# EAGLE design gwx-control (EAGLE 7.7.0)
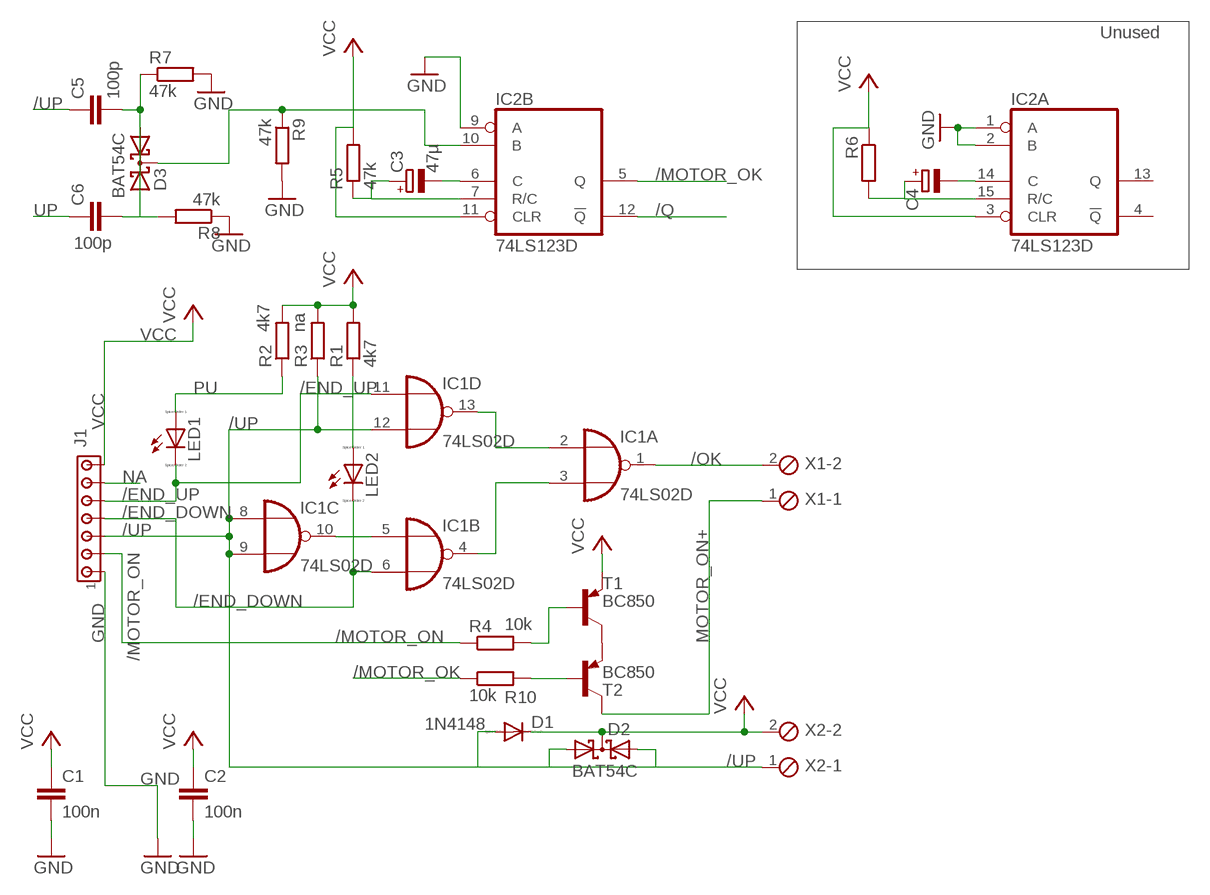
[diagram p0: schematic, sheet 1]

## Parts
C1  100n  C-EUC0603K  [C0603K]
C2  100n  C-EUC0603K  [C0603K]
C3  47µ  CPOL-EUE5-6  [E5-6]
C4  CPOL-EUE5-6  [E5-6]
C5  100p  C-EUC0603K  [C0603K]
C6  100p  C-EUC0603K  [C0603K]
D1  1N4148  1N4148DO35-10  [DO35-10]
D2  BAT54C  [SOT23]
D3  BAT54C  [SOT23]
IC1  74LS02D  [SO14]
IC2  74LS123D  [SO16]
J1  MTA07-100  [10X07MTA]
LED1  LED_ESML0603  [LED_SML0603]
LED2  LED_ESML0603  [LED_SML0603]
R1  4k7  R-EU_R0603  [R0603]
R2  4k7  R-EU_R0603  [R0603]
R3  na  R-EU_R0603  [R0603]
R4  10k  R-EU_R0603  [R0603]
R5  47k  R-EU_R0603  [R0603]
R6  R-EU_R0603  [R0603]
R7  47k  R-EU_R0603  [R0603]
R8  47k  R-EU_R0603  [R0603]
R9  47k  R-EU_R0603  [R0603]
R10  10k  R-EU_R0603  [R0603]
T1  BC850  BC856B-PNP-SOT23-BEC  [SOT23-BEC]
T2  BC850  BC856B-PNP-SOT23-BEC  [SOT23-BEC]
X1  MPT2  [2POL254]
X2  MPT2  [2POL254]

## Nets
/END_DOWN: IC1.6(B:I1) J1.4 LED2.C
/END_UP: IC1.11(D:I0) J1.5 LED1.C
/MOTOR_OK: IC2.5(B:Q) R10.1
/MOTOR_ON: J1.2 R4.1
/OK: IC1.1(A:O) X1.2
/Q: IC2.12(B:!Q)
/UP: C5.1 D1.A D2.1(A1) D2.2(A2) IC1.8(C:I0) IC1.9(C:I1) IC1.12(D:I1) J1.3 R3.1 X2.1
GND: C1.2 C2.2 IC2.1(A:A) IC2.2(A:B) IC2.9(B:A) J1.1 R7.2 R8.1 R9.2
MOTOR_ON+: T2.C X1.1
N$1: C3.+ IC2.7(B:R/C) R5.1
N$2: C3.- IC2.6(B:C)
N$3: C4.+ IC2.15(A:R/C) R6.2
N$4: C5.2 D3.2(A2) R7.1
N$5: IC1.2(A:I0) IC1.13(D:O)
N$6: IC1.3(A:I1) IC1.4(B:O)
N$7: C6.2 D3.1(A1) R8.2
N$8: D3.3(CC) IC2.10(B:B) R9.1
N$9: C4.- IC2.14(A:C)
N$10: R10.2 T2.B
N$11: R4.2 T1.B
N$12: T1.C T2.E
N$15: LED2.A R1.1
NA: J1.6
PU: LED1.A R2.1
UP: C6.1 IC1.5(B:I0) IC1.10(C:O)
VCC: C1.1 C2.1 D1.C D2.3(CC) IC2.3(A:CLR) IC2.11(B:CLR) J1.7 R1.2 R2.2 R3.2 R5.2 R6.1 T1.E X2.2
Unconnected: IC2.4(A:!Q) IC2.13(A:Q)

## Notes on the sheet
- Unused

## Power pins joined to a net without a drawn wire
GND: IC1.7(P:GND) IC2.8(P:GND)
VCC: IC1.14(P:VCC) IC2.16(P:VCC)

## Library data of the parts
C1 C2 C5 C6 = rcl:C-EU: CAPACITOR, European symbol
C3 C4 = rcl:CPOL-EU: POLARIZED CAPACITOR, European symbol
D1 = diode:1N4148: DIODE high speed (Philips)
D2 D3 = diode:BAT54C: Schottky Diodes Source: Fairchild .. BAT54.pdf
IC1 = 74xx-eu:74*02: Quad 2-input NOR gate
IC2 = 74xx-eu:74*123: Retriggerable monostable MULTIVIBRATOR
J1 = con-amp:MTA07-100: AMP connector
LED1 LED2 = eagle-ltspice:LED_E: LED Source: http://www.osram.convergy.de Source: www.luxeon.com Source: www.kingbright.com; SPICEMODEL: NONE; SPICEPREFIX: D; SPICETYPE: diode
R1-R4 R10 = resistor:R-EU_: RESISTOR, European symbol
R5-R9 = rcl:R-EU_: RESISTOR, European symbol
T1 T2 = transistor:*-PNP-: PNP Transistror
X1 X2 = con-phoenix-254:MPT2: PHOENIX CONNECTOR; OC_FARNELL: unknown; OC_NEWARK: unknown

## Board
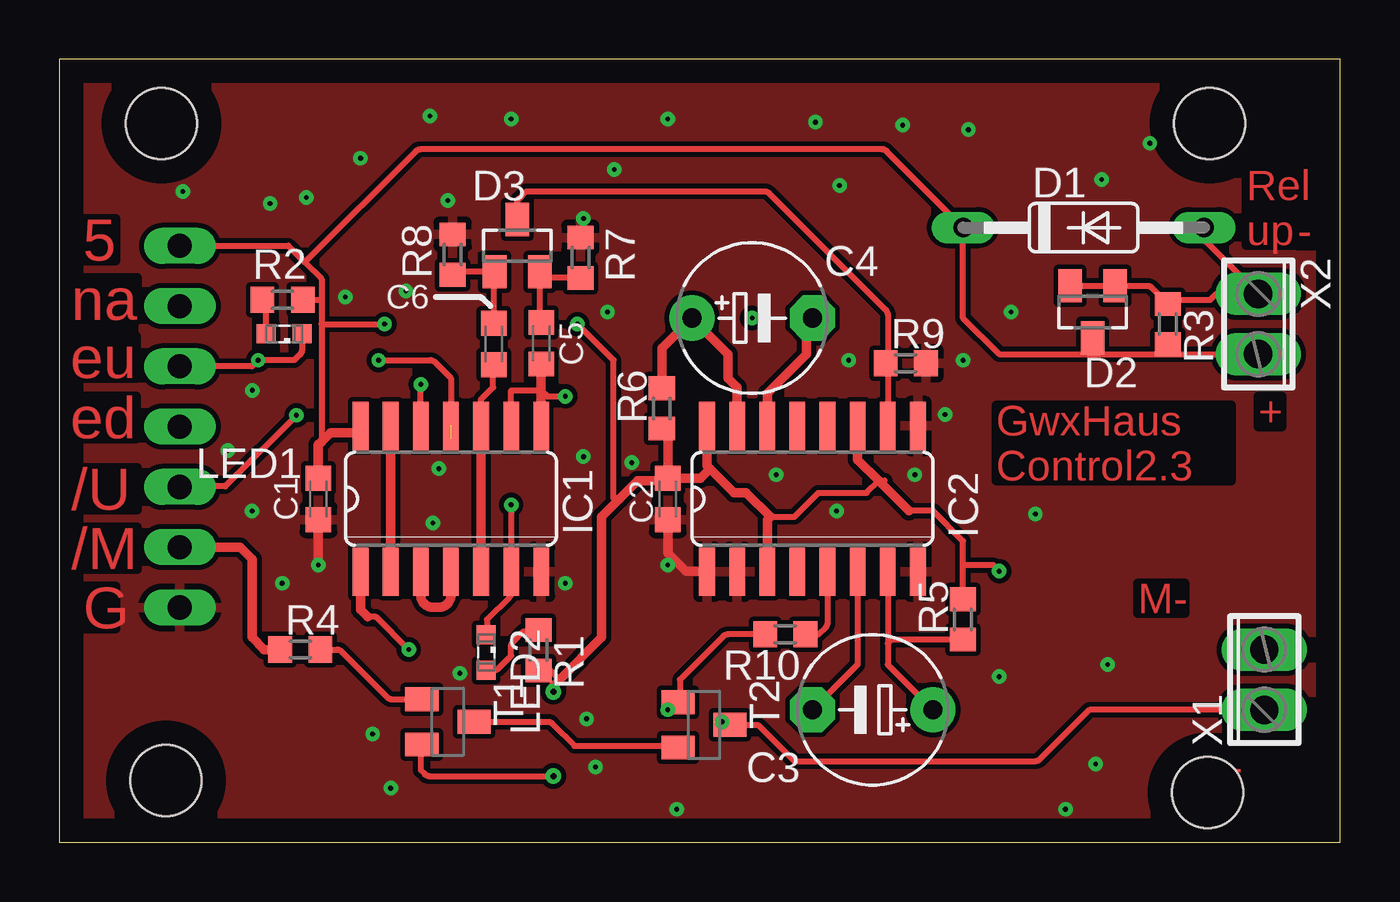
[diagram p1: board, top side]
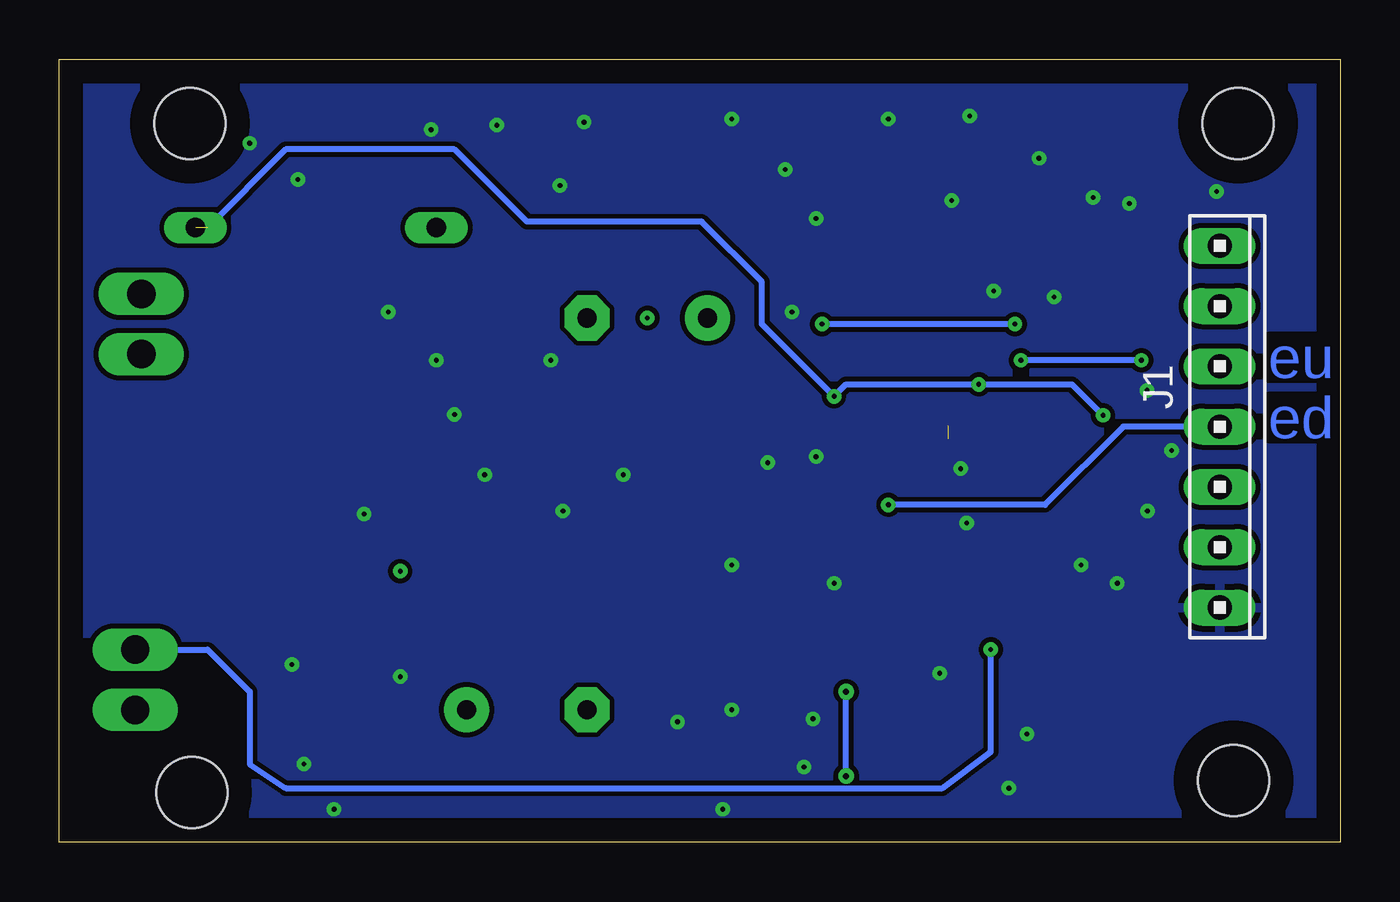
[diagram p2: board, bottom side, seen from below]

Size 54 x 33 mm. Coordinates in mm from the lower left corner, seen from the top.
Outline: 0,0 54,0 54,33 0,33 0,0
Copper layers (1*16): Top 0.035mm / dielectric 1.5mm / Bottom 0.035mm
Design rules "default *": minimum track width 10mil, minimum drill 24mil, track to track 8mil, track to pad 8mil, pad to pad 8mil, via to via 8mil, smd to smd 8mil, copper to edge 40mil, drill to drill 8mil, minimum pad ring 10mil, minimum via ring 8mil, stop-mask expansion 4mil, vias tented up to drill 13mil, thermal gap 10mil
Holes 3 mm at 4.3,30.3 4.5,2.6 48.5,30.3 48.4,2.1

### Footprints (pad centres in the part's own frame; a part is rotated, then mirrored left to right if it is on the bottom)
C0603K = smd 1.05 x 1.08: 1 -0.875,0; 2 0.875,0
E5-6 = drill 0.813 pad 1.905: + -2.54,0 | drill 0.813 pad 1.905 octagon: - 2.54,0
DO35-10 = drill 0.813 long: A 5.08,0; C -5.08,0
SOT23 = smd 1 x 1.4: 1 -0.95,-1.1; 2 0.95,-1.1; 3 0,1.1
SO14 = smd 0.66 x 2.032: 1 -3.81,-3.073; 2 -2.54,-3.073; 3 -1.27,-3.073; 4 0,-3.073; 5 1.27,-3.073; 6 2.54,-3.073; 7 3.81,-3.073; 8 3.81,3.073; 9 2.54,3.073; 10 1.27,3.073; 11 0,3.073; 12 -1.27,3.073; 13 -2.54,3.073; 14 -3.81,3.073
SO16 = smd 0.66 x 2.032: 1 -4.445,-3.073; 2 -3.175,-3.073; 3 -1.905,-3.073; 4 -0.635,-3.073; 5 0.635,-3.073; 6 1.905,-3.073; 7 3.175,-3.073; 8 4.445,-3.073; 9 4.445,3.073; 10 3.175,3.073; 11 1.905,3.073; 12 0.635,3.073; 13 -0.635,3.073; 14 -1.905,3.073; 15 -3.175,3.073; 16 -4.445,3.073
10X07MTA = drill 1.016 long: 1 7.62,0; 2 5.08,0; 3 2.54,0; 4 0,0; 5 -2.54,0; 6 -5.08,0; 7 -7.62,0
LED_SML0603 = smd 0.8 x 0.8: A 0.75,0; C -0.75,0
R0603 = smd 1 x 1.1: 1 -0.85,0; 2 0.85,0
SOT23-BEC = smd 1 x 1.4: B -0.95,-1.1; C 0,1.1; E 0.95,-1.1
2POL254 = drill 1.2 long: 1 -1.27,0; 2 1.27,0

### Placement (x,y rotation side)
C1  10.92,14.48 270 top
C2  25.65,14.48 270 top
C3  34.29,5.59 180 top
C4  29.21,22.1 0 top
C5  20.32,21.04 90 top
C6  18.32,21 90 top
D1  43.18,25.91 0 top
D2  43.56,22.35 180 top
D3  19.3,25.15 0 top
IC1  16.51,14.48 0 top
IC2  31.75,14.48 0 top
J1  5.08,17.52 270 bottom
LED1  9.48,21.43 180 top
LED2  18,8 270 top
R1  20.2,8.1 270 top
R2  9.41,22.86 0 top
R3  46.74,21.84 270 top
R4  10.16,8.13 0 top
R5  38.1,9.4 90 top
R6  25.4,18.29 90 top
R7  21.97,24.64 90 top
R8  16.58,24.77 270 top
R9  35.69,20.19 0 top
R10  30.61,8.76 180 top
T1  16.38,5.08 270 top
T2  27.18,4.95 270 top
X1  50.8,6.86 90 top
X2  50.55,21.84 270 top

### Tracks (layer width: path | path; a pad name or v marks a point on that pad's centre or on a via)
/END_DOWN  (via drill 0.2 pad 0.25)
  Top 0.254: v19.05,14.22 IC1.6 19.05,10.52 arc-45 18.98,10.34 18.03,9.4 18.03,8.83 arc-45 LED2.C
  Bottom 0.254: J1.4 9.14,17.53 12.45,14.22 v19.05,14.22
/END_UP  (via drill 0.2 pad 0.25)  (1 unrouted)
  Top 0.254: J1.5 8.12,20.06 v8.38,20.32 9.91,20.32 10.16,20.57 arc45 10.23,20.75 LED1.C | v13.46,20.32 15.64,20.32 arc-45 15.82,20.25 16.51,19.56 16.51,17.02
  Bottom 0.254: v8.38,20.32 v13.46,20.32
/MOTOR_OK
  Top 0.254: IC2.5 32.38,9.25 arc-45 32.31,9.07 32,8.76 R10.1
/MOTOR_ON
  Top 0.406: J1.2 7.62,12.45 8.13,11.94 8.13,8.64 8.64,8.13 R4.1
/OK  (via drill 0.2 pad 0.25)
  Top 0.254: v14.73,8.13 13.35,9.51 13,9.51
  Top 0.406: IC1.1 12.7,9.81 13,9.51
  Bottom 0.254: X1.2 47.75,8.13 45.97,6.35 45.97,3.3 44.45,2.29 16.76,2.29 14.73,3.81 v14.73,8.13
/UP  (via drill 0.2 pad 0.25, 0.2 pad 0.61)  (1 unrouted)
  Top 0.254: v21.34,18.8 20.57,18.8 20.32,19.05 19.05,19.05 IC1.9 | IC1.12 v15.24,19.3 | 50.55,23.62 X2.1 | X2.1 48.77,23.11 48.51,22.86 46.9,22.86 R3.1 46.05,23.38 arc45 45.87,23.45 D2.1 D2.2 | v10,18 7,15 5.1,15 J1.3 | D1.A 48.26,25.5 arc45 48.33,25.33 X2.1
  Top 0.406: IC1.8 20.32,19.05 C5.1
  Bottom 0.254: 47.75,25.91 44.45,29.21 37.34,29.21 34.29,26.16 26.92,26.16 24.38,23.62 24.38,21.84 v21.34,18.8 20.83,19.3 v15.24,19.3 11.3,19.3 v10,18
GND  (via drill 0.2 pad 0.25)
  Top 0.406: C1.2 10.92,11.94 | C2.2 25.65,12.19 26.42,11.43 27.28,11.43 IC2.1
  other vias: 8.14,19.05 16,15.75 15.75,13.46 22.1,16.26 21.34,10.92 25.65,11.68 30.23,15.49 32.77,13.97 19.05,30.48 23.11,22.35 22.1,26.29 33.27,20.32 24.13,16 23.4,28.35 5.21,27.43 36.07,15.49 8.89,26.92 10.41,27.18 12.7,28.83 15.62,30.61 25.65,30.48 31.88,30.35 35.56,30.23 32.89,27.69 45.97,29.46 43.94,27.94 38.32,30.04 40.13,22.35 38.1,20.32 37.34,18.03 44.2,7.49 39.62,6.99 25.65,5.59 16.89,7.13 13.21,4.57 9.4,10.92 10.92,11.68 8.13,13.97 7.11,16.51 16.38,27.05 14.61,23.24 12.06,22.99 41.15,13.84 27.94,5.08 22.23,5.21 22.61,3.17 13.97,2.29 26.04,1.4 42.42,1.4 43.69,3.3
  pour Top: -2,36 56,36.51 56,-0.49 -2,-1
  pour Top: 55,-0.49 -2,-1 -2,36 55,36.51
  pour Bottom: -2,37 -1,37 55,37 55,36 55,-1 -2,-1
MOTOR_ON+
  Top 0.254: X1.1 43.43,5.59 41.35,3.5 arc-45 41.17,3.43 30.99,3.43 29.54,4.88 arc45 29.36,4.95 T2.C
N$1
  Top 0.254: IC2.7 34.92,8.38 | 34.92,8.38 34.92,7.49 C3.+ | R5.1 35.09,8.55 34.92,8.38
N$2
  Top 0.254: IC2.6 33.66,7.49 C3.-
N$3
  Top 0.406: IC2.15 28.57,19.18 28.19,19.56 28.19,20.57 C4.+ 25.4,20.83 R6.2
N$4
  Top 0.254: C5.2 20.26,21.97 arc-45 20.25,21.99 D3.2 20.5,23.8 arc45 20.52,23.79 R7.1
N$5
  Top 0.406: IC1.2 IC1.13
N$6
  Top 0.406: IC1.3 15.24,10.41 arc90 15.75,9.91 16,9.91 arc90 16.51,10.41 IC1.4
N$7
  Top 0.254: C6.2 18.32,24 arc-45 18.33,24.02 D3.1 16.59,24.05 arc45 16.57,24.04 R8.2
N$8
  Top 0.254: D3.3 19.3,26.95 arc-45 19.38,27.12 19.68,27.43 29.74,27.43 arc-45 29.92,27.36 34.85,22.43 arc-45 34.92,22.25 34.92,20.19 | 34.92,20.19 IC2.10 | R9.1 34.92,20.19
N$9
  Top 0.406: IC2.14 29.84,18.92 31.5,20.57 31.5,21.84 C4.-
N$10
  Top 0.254: R10.2 28.17,8.76 arc45 27.99,8.69 26.16,6.86 26.16,6.09 arc-45 26.09,5.91 T2.B
N$11
  Top 0.254: R4.2 11.71,8.13 arc-45 11.88,8.05 13.84,6.1 arc45 14.01,6.03 T1.B
N$12
  Top 0.254: T1.C 20.6,5.08 arc-45 20.77,5.01 21.72,4.06 25.93,4.06 arc-45 T2.E
N$13  (via drill 0.2 pad 0.25)
  other vias: 29.21,22.1
N$15
  Top 0.254: LED2.A 18.32,7.25 arc45 18.5,7.32 19.05,7.87 19.05,8.28 arc-45 19.12,8.46 19.56,8.89 20.06,8.89 arc45 R1.1
PU
  Top 0.254: LED1.A 8.73,22.59 arc45 8.66,22.77 R2.1
UP
  Top 0.254: IC1.10 17.78,18.66 arc-45 17.79,18.68 18.29,19.18 18.29,20.08 arc-45 18.3,20.1 C6.1
  Top 0.406: IC1.5 IC1.10
VCC  (via drill 0.2 pad 0.25, 0.25)
  Top 0.254: R5.2 38.1,11.68 | 38.1,11.68 38.1,12.7 36.83,13.97 35.81,13.97 | 34.8,15.24 34.67,15.11 | 29.97,13.72 30.99,13.72 32,14.73 34.04,14.73 34.54,15.24 | J1.7 9.65,25.15 10.35,24.45 | 10.35,24.45 11.05,23.75 11.05,22.86 | 11.05,22.86 11.05,21.84 | 11.05,21.84 11.05,16.89 | v39.62,11.43 39.37,11.68 38.1,11.68 | 23.62,14.48 23.37,14.48 23.37,20.32 v21.84,21.84 | 11.05,21.84 v13.72,21.84 | 43.69,20.57 39.62,20.57 38.1,22.1 D1.C 34.87,29.14 arc45 34.69,29.21 15.22,29.21 arc45 15.04,29.14 10.35,24.45 | 43.69,20.57 46.86,20.57 | 46.86,20.57 X2.2 | R3.2 46.79,20.94 arc-45 46.86,20.76 46.86,20.57 | T1.E arc45 15.24,4.03 15.24,3.05 15.42,2.87 arc45 15.6,2.79 v20.83,2.79 | D2.3 43.56,20.81 arc45 43.63,20.63 43.69,20.57 | R1.2 20.59,7.25 arc-45 20.77,7.17 21.08,6.86 | R2.2 11.05,22.86
  Top 0.406: IC2.16 27.3,15.88 27.43,15.75 | 27.43,15.75 28.45,14.73 28.96,14.73 29.97,13.72 29.84,13.59 IC2.3 | IC2.11 33.66,16.13 34.54,15.24 34.67,15.11 35.81,13.97 | C1.1 10.92,16.76 11.05,16.89 11.43,17.27 12.42,17.27 IC1.14 | C2.1 27.04,15.35 27.43,15.75 | C2.1 25.65,17.18 R6.1 | v20.83,6.35 20.83,6.6 21.08,6.86 22.86,8.64 22.86,13.72 23.62,14.48 24.38,15.24 25.54,15.24 C2.1
  Bottom 0.254: v20.83,2.79 v20.83,6.35 | v13.72,21.84 v21.84,21.84

### Text on the board
Top: 5 | Rel / up | - | na | eu | + | ed | GwxHaus / Control2.3 | /U | /M | M- | G | -
Bottom: eu | ed